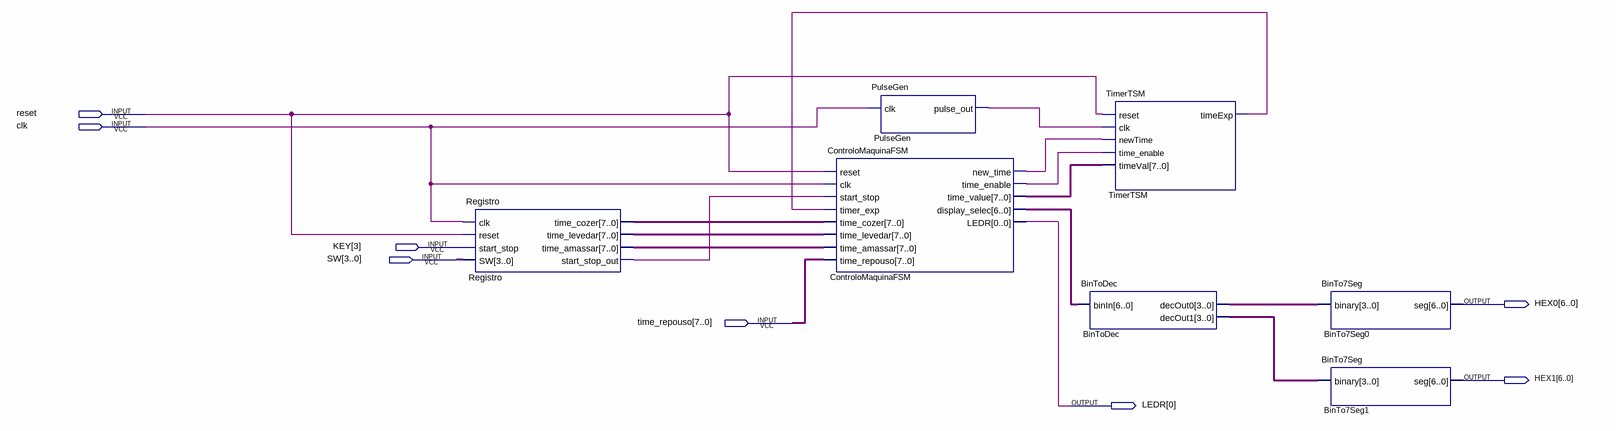
[diagram p0: schematic sheet]
// Quartus schematic Schematic.bdf as structural Verilog: 7 symbols, 8 pins
module Schematic (
  input  reset,
  input  clk,
  input  [3:3] KEY,
  input  [3:0] SW,
  input  [7:0] time_repouso,
  output [6:0] HEX0,
  output [6:0] HEX1,
  output [0:0] LEDR
);

  wire ControloMaquinaFSM_new_time, ControloMaquinaFSM_time_enable, PulseGen_pulse_out,
       Registro_start_stop_out, TimerTSM_timeexp;
  wire [3:0] BinToDec_decout0, BinToDec_decout1;
  wire [6:0] ControloMaquinaFSM_display_selec;
  wire [7:0] ControloMaquinaFSM_time_value, Registro_time_amassar, Registro_time_cozer, Registro_time_levedar;

  Registro Registro (
    .clk(clk), .reset(reset), .start_stop(KEY[3]), .SW(SW), .time_cozer(Registro_time_cozer),
    .time_levedar(Registro_time_levedar), .time_amassar(Registro_time_amassar),
    .start_stop_out(Registro_start_stop_out));
  ControloMaquinaFSM ControloMaquinaFSM (
    .reset(reset), .clk(clk), .start_stop(Registro_start_stop_out), .timer_exp(TimerTSM_timeexp),
    .time_cozer(Registro_time_cozer), .time_levedar(Registro_time_levedar),
    .time_amassar(Registro_time_amassar), .time_repouso(time_repouso),
    .new_time(ControloMaquinaFSM_new_time), .time_enable(ControloMaquinaFSM_time_enable),
    .time_value(ControloMaquinaFSM_time_value), .display_selec(ControloMaquinaFSM_display_selec),
    .LEDR(LEDR[0]));
  PulseGen PulseGen (.clk(clk), .pulse_out(PulseGen_pulse_out));
  BinToDec BinToDec (.binIn(ControloMaquinaFSM_display_selec), .decOut0(BinToDec_decout0), .decOut1(BinToDec_decout1));
  TimerTSM TimerTSM (
    .reset(reset), .clk(PulseGen_pulse_out), .newTime(ControloMaquinaFSM_new_time),
    .time_enable(ControloMaquinaFSM_time_enable), .timeVal(ControloMaquinaFSM_time_value),
    .timeExp(TimerTSM_timeexp));
  BinTo7Seg BinTo7Seg0 (.binary(BinToDec_decout0), .seg(HEX0));
  BinTo7Seg BinTo7Seg1 (.binary(BinToDec_decout1), .seg(HEX1));
endmodule
